# EAGLE design RangeHood (EAGLE 8.5.0)

## Sheet 1 of 2
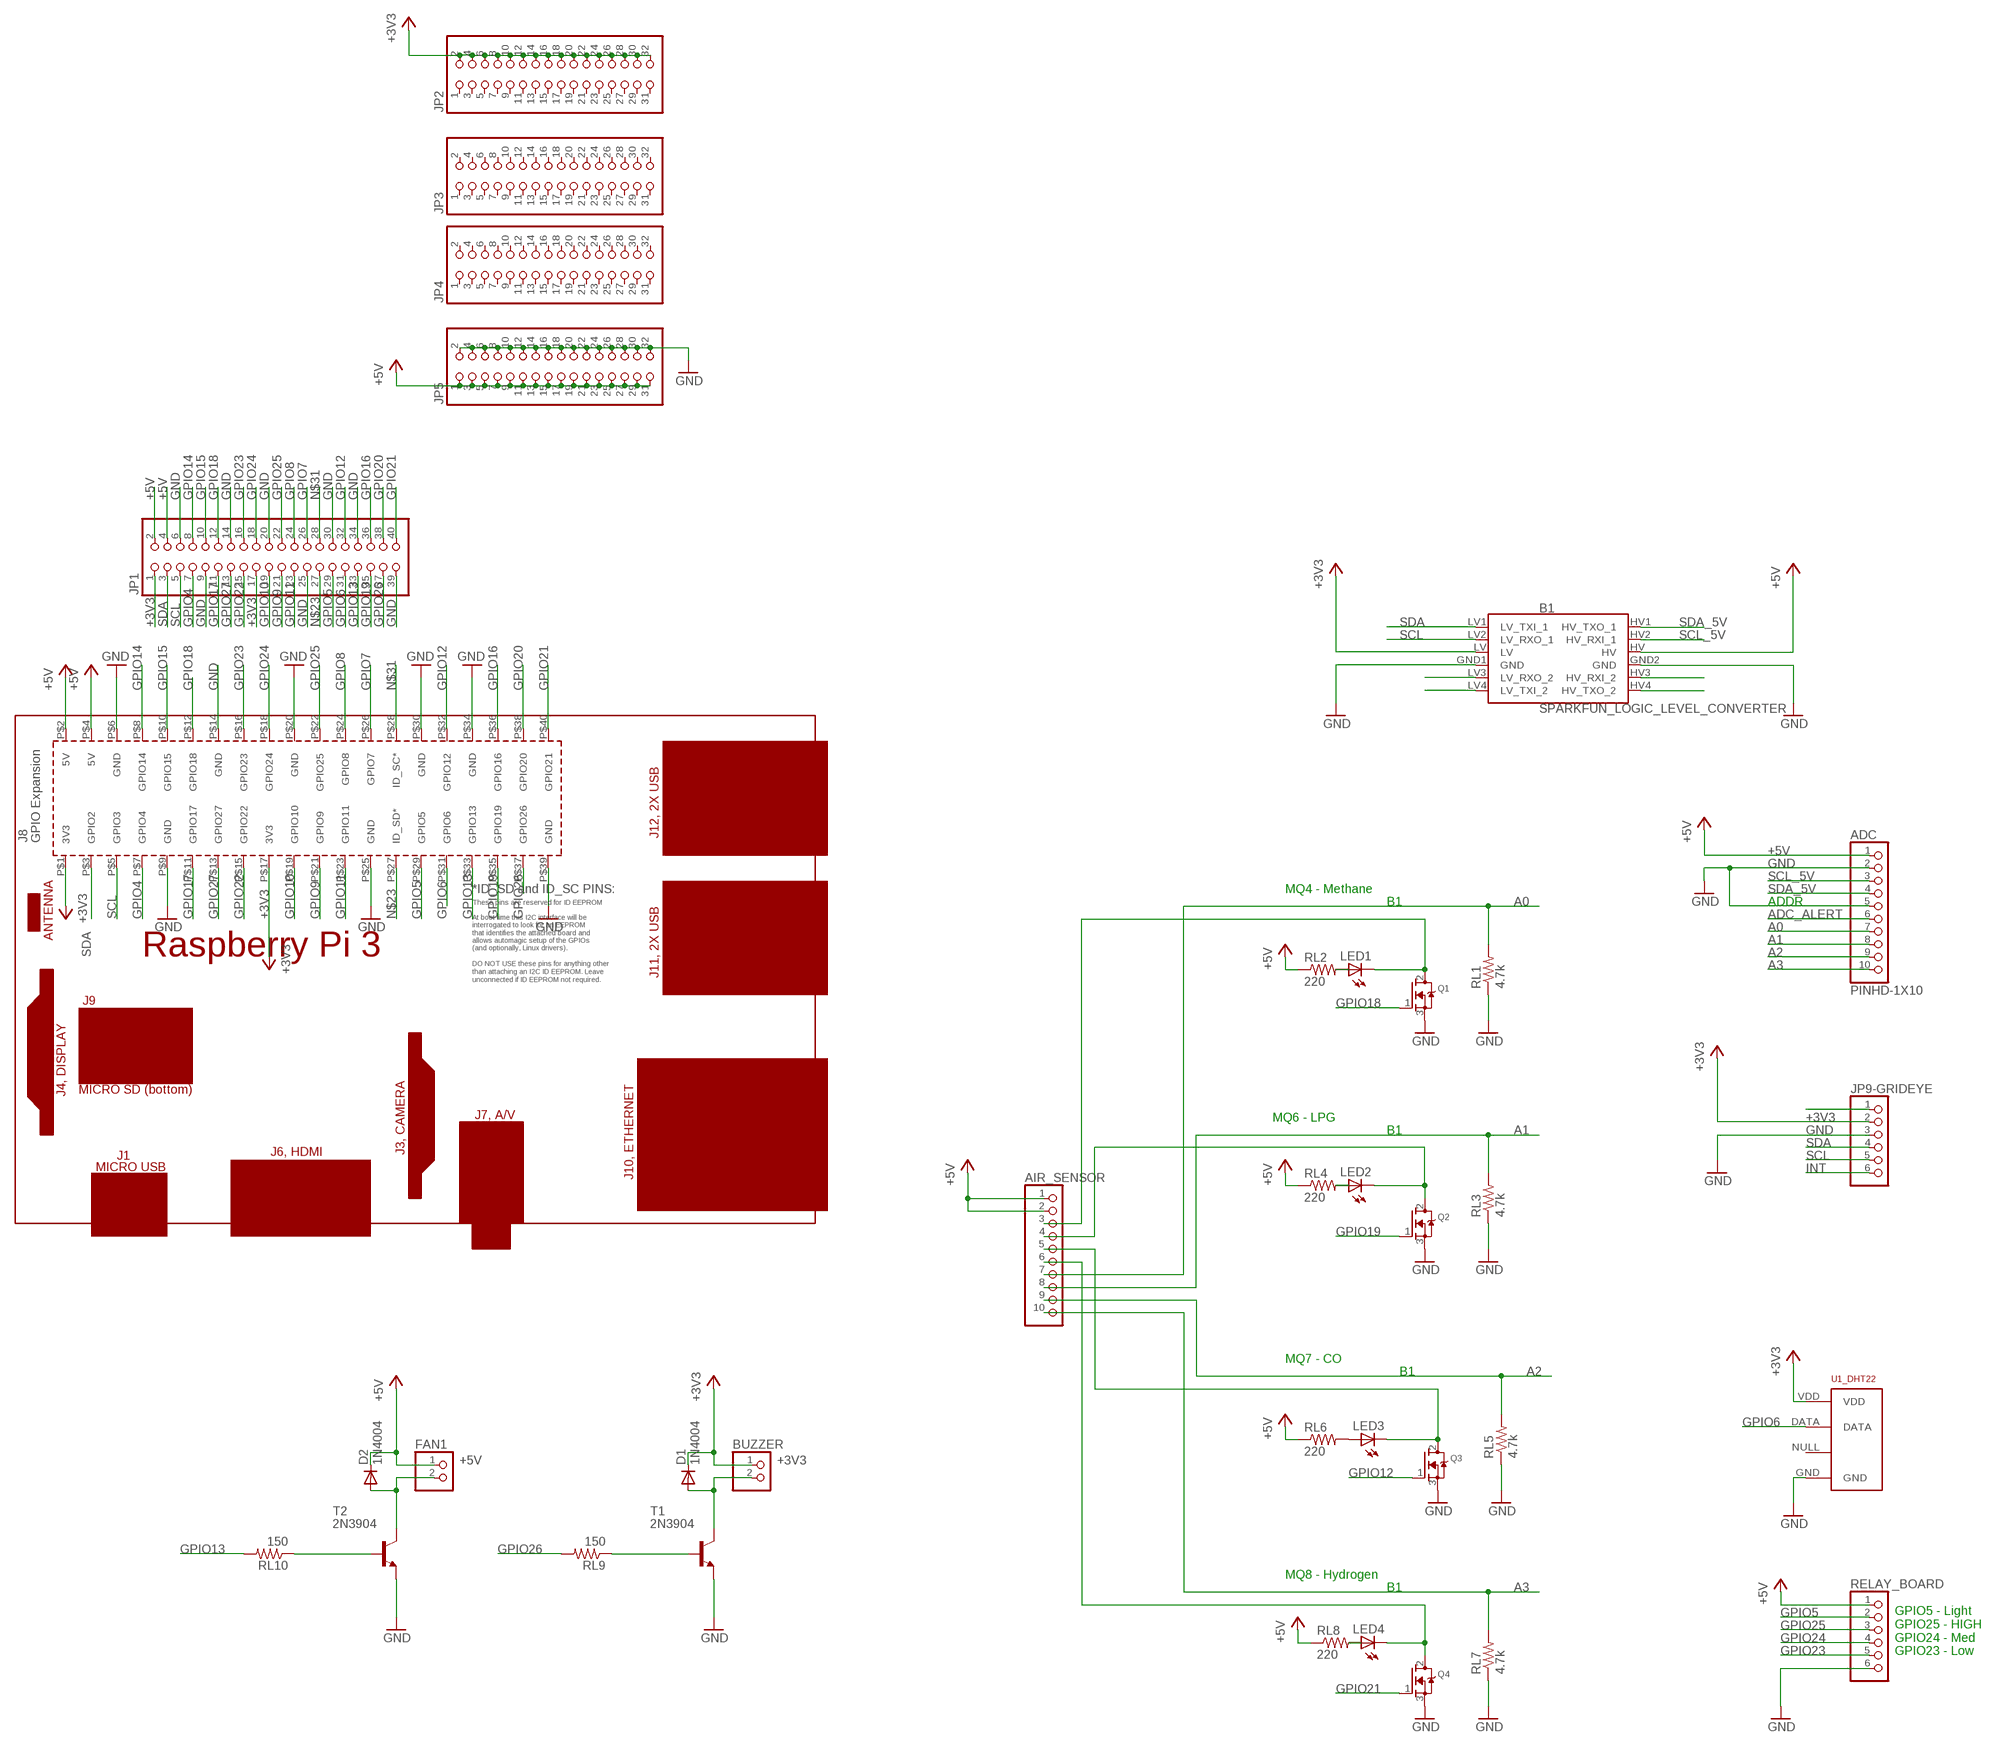
[diagram p0: schematic, sheet 1]

### Parts
ADC  PINHD-1X10  [1X10-BIG]
AIR_SENSOR  PINHD-1X10  [1X10]
B1  SPARKFUN_LOGIC_LEVEL_CONVERTER  [SPARKFUN_LOGIC_LEVEL_CONVERTER]
BUZZER  PINHD-1X2  [1X02]
D1  1N4004  [DO41-10]
D2  1N4004  [DO41-10]
FAN1  PINHD-1X2  [1X02]
JP1  PINHD-2X20  [2X20]
JP2  PINHD-2X16  [2X16]
JP3  PINHD-2X16  [2X16]
JP4  PINHD-2X16  [2X16]
JP5  PINHD-2X16  [2X16]
JP9-GRIDEYE  PINHD-1X6  [1X06]
LED1  LED3MM  [LED3MM]
LED2  LED3MM  [LED3MM]
LED3  LED3MM  [LED3MM]
LED4  LED3MM  [LED3MM]
PCB1  RPI3  [RPI3]
Q1  MOSFET-NGDS_TO220V  [TO220V]
Q2  MOSFET-NGDS_TO220V  [TO220V]
Q3  MOSFET-NGDS_TO220V  [TO220V]
Q4  MOSFET-NGDS_TO220V  [TO220V]
RELAY_BOARD  PINHD-1X6  [1X06]
RL1  4.7k  R-US_M0805  [M0805]
RL2  220  R-US_M0805  [M0805]
RL3  4.7k  R-US_M0805  [M0805]
RL4  220  R-US_M0805  [M0805]
RL5  4.7k  R-US_M0805  [M0805]
RL6  220  R-US_M0805  [M0805]
RL7  4.7k  R-US_M0805  [M0805]
RL8  220  R-US_M0805  [M0805]
RL9  150  R-US_M0805  [M0805]
RL10  150  R-US_M0805  [M0805]
T1  2N3904  [TO92]
T2  2N3904  [TO92]
U1_DHT22  RHT03_DHT-22_AM2302  [RHT03_DHT-22]

### Nets
+3V3: B1.LV BUZZER.1 D1.C JP1.1 JP1.17 JP2.2 JP2.4 JP2.6 JP2.8 JP2.10 JP2.12 JP2.14 JP2.16 JP2.18 JP2.20 JP2.22 JP2.24 JP2.26 JP2.28 JP2.30 JP2.32 JP9-GRIDEYE.2 PCB1.P$1(3V3) PCB1.P$17(3V3) U1_DHT22.VDD
+5V: ADC.1 AIR_SENSOR.1 AIR_SENSOR.2 B1.HV D2.C FAN1.1 JP1.2 JP1.4 JP5.1 JP5.3 JP5.5 JP5.7 JP5.9 JP5.11 JP5.13 JP5.15 JP5.17 JP5.19 JP5.21 JP5.23 JP5.25 JP5.27 JP5.29 JP5.31 PCB1.P$2(5V) PCB1.P$4(5V) RELAY_BOARD.1 RL2.1 RL4.1 RL6.1 RL8.1
A0: ADC.7 AIR_SENSOR.7 RL1.2
A1: ADC.8 AIR_SENSOR.8 RL3.2
A2: ADC.9 AIR_SENSOR.9 RL5.2
A3: ADC.10 AIR_SENSOR.10 RL7.2
ADC_ALERT: ADC.6
GND: ADC.2 ADC.5 B1.GND1(GND) B1.GND2(GND) JP1.6 JP1.9 JP1.14 JP1.20 JP1.25 JP1.30 JP1.34 JP1.39 JP5.2 JP5.4 JP5.6 JP5.8 JP5.10 JP5.12 JP5.14 JP5.16 JP5.18 JP5.20 JP5.22 JP5.24 JP5.26 JP5.28 JP5.30 JP5.32 JP9-GRIDEYE.3 PCB1.P$6(GND) PCB1.P$9(GND) PCB1.P$14(GND) PCB1.P$20(GND) PCB1.P$25(GND) PCB1.P$30(GND) PCB1.P$34(GND) PCB1.P$39(GND) Q1.3(S) Q2.3(S) Q3.3(S) Q4.3(S) RELAY_BOARD.6 RL1.1 RL3.1 RL5.1 RL7.1 T1.3(E) T2.3(E) U1_DHT22.GND
GPIO4: JP1.7 PCB1.P$7(GPIO4)
GPIO5: JP1.29 PCB1.P$29(GPIO5) RELAY_BOARD.2
GPIO6: JP1.31 PCB1.P$31(GPIO6) U1_DHT22.DATA
GPIO7: JP1.26 PCB1.P$26(GPIO7)
GPIO8: JP1.24 PCB1.P$24(GPIO8)
GPIO9: JP1.21 PCB1.P$21(GPIO9)
GPIO10: JP1.19 PCB1.P$19(GPIO10)
GPIO11: JP1.23 PCB1.P$23(GPIO11)
GPIO12: JP1.32 PCB1.P$32(GPIO12) Q3.1(G)
GPIO13: JP1.33 PCB1.P$33(GPIO13) RL10.2
GPIO14: JP1.8 PCB1.P$8(GPIO14)
GPIO15: JP1.10 PCB1.P$10(GPIO15)
GPIO16: JP1.36 PCB1.P$36(GPIO16)
GPIO17: JP1.11 PCB1.P$11(GPIO17)
GPIO18: JP1.12 PCB1.P$12(GPIO18) Q1.1(G)
GPIO19: JP1.35 PCB1.P$35(GPIO19) Q2.1(G)
GPIO20: JP1.38 PCB1.P$38(GPIO20)
GPIO21: JP1.40 PCB1.P$40(GPIO21) Q4.1(G)
GPIO22: JP1.15 PCB1.P$15(GPIO22)
GPIO23: JP1.16 PCB1.P$16(GPIO23) RELAY_BOARD.5
GPIO24: JP1.18 PCB1.P$18(GPIO24) RELAY_BOARD.4
GPIO25: JP1.22 PCB1.P$22(GPIO25) RELAY_BOARD.3
GPIO26: JP1.37 PCB1.P$37(GPIO26) RL9.2
GPIO27: JP1.13 PCB1.P$13(GPIO27)
INT: JP9-GRIDEYE.6
N$1: LED2.A RL4.2
N$2: AIR_SENSOR.5 LED3.K(C) Q3.2(D)
N$3: LED1.A RL2.2
N$4: AIR_SENSOR.3 LED1.K(C) Q1.2(D)
N$5: LED3.A RL6.2
N$6: D2.A FAN1.2 T2.1(C)
N$7: LED4.A RL8.2
N$8: AIR_SENSOR.6 LED4.K(C) Q4.2(D)
N$9: BUZZER.2 D1.A T1.1(C)
N$10: JP9-GRIDEYE.1
N$11: RL9.1 T1.2(B)
N$12: RL10.1 T2.2(B)
N$16: B1.LV3(LV_RXO_2)
N$17: B1.LV4(LV_TXI_2)
N$18: B1.HV4(HV_TXO_2)
N$19: B1.HV3(HV_RXI_2)
N$23: JP1.27 PCB1.P$27(ID_SD*)
N$31: JP1.28 PCB1.P$28(ID_SC*)
N$41: AIR_SENSOR.4 LED2.K(C) Q2.2(D)
SCL: B1.LV2(LV_RXO_1) JP1.5 JP9-GRIDEYE.5 PCB1.P$5(GPIO3)
SCL_5V: ADC.3 B1.HV2(HV_RXI_1)
SDA: B1.LV1(LV_TXI_1) JP1.3 JP9-GRIDEYE.4 PCB1.P$3(GPIO2)
SDA_5V: ADC.4 B1.HV1(HV_TXO_1)
Unconnected: JP2.1 JP2.3 JP2.5 JP2.7 JP2.9 JP2.11 JP2.13 JP2.15 JP2.17 JP2.19 JP2.21 JP2.23 JP2.25 JP2.27 JP2.29 JP2.31 JP3.1 JP3.2 JP3.3 JP3.4 JP3.5 JP3.6 JP3.7 JP3.8 JP3.9 JP3.10 JP3.11 JP3.12 JP3.13 JP3.14 JP3.15 JP3.16 JP3.17 JP3.18 JP3.19 JP3.20 JP3.21 JP3.22 JP3.23 JP3.24 JP3.25 JP3.26 JP3.27 JP3.28 JP3.29 JP3.30 JP3.31 JP3.32 JP4.1 JP4.2 JP4.3 JP4.4 JP4.5 JP4.6 JP4.7 JP4.8 JP4.9 JP4.10 JP4.11 JP4.12 JP4.13 JP4.14 JP4.15 JP4.16 JP4.17 JP4.18 JP4.19 JP4.20 JP4.21 JP4.22 JP4.23 JP4.24 JP4.25 JP4.26 JP4.27 JP4.28 JP4.29 JP4.30 JP4.31 JP4.32 U1_DHT22.NULL

### Notes on the sheet
- MQ4 - Methane
- B1 | ADDR
- MQ6 - LPG
- B1
- MQ7 - CO
- B1
- MQ8 - Hydrogen
- B1
- GPIO5 - Light
  GPIO25 - HIGH
  GPIO24 - Med
  GPIO23 - Low

## Sheet 2 of 2

## Library data of the parts
ADC = adafruit:PINHD-1X10: Pin header 1x10 0.1" spacing With round pins
AIR_SENSOR = pinhead:PINHD-1X10: PIN HEADER
B1 = SparkFun-Boards:SPARKFUN_LOGIC_LEVEL_CONVERTER: SparkFun Logic Level Converter -Bi-Directional This is the mechnical outline for the 3.3V - 5V bi directional logic level converter. *Note, the "LOCK" Package has the header pins staggered by an offset of 5 mils (off center line), so that when you slide a row of standard 0.1" headers into the PTH pads, it will hold position vertically. See the follwing turorial for more information on this type of special footprints: Sneaky Footprints <https://www.sparkfun.com/tutorials/114> SparkFun Products: SparkFun Logic Level Converter - Bi-Directional <https://www.sparkfun.com/products/12009>
BUZZER FAN1 = pinhead:PINHD-1X2: PIN HEADER
D1 D2 = adafruit:1N4004: DIODE General purpose 1N400x type rectifier (With bigger pads) http://www.ladyada.net/library/pcb/eaglelibrary.html
JP1 = pinhead:PINHD-2X20: PIN HEADER
JP2-JP5 = pinhead:PINHD-2X16: PIN HEADER
JP9-GRIDEYE RELAY_BOARD = pinhead:PINHD-1X6: PIN HEADER
LED1-LED4 = adafruit:LED: LED OSRAM: - CHIPLED LG R971, LG N971, LY N971, LG Q971, LY Q971, LO R971, LY R971 LH N974, LH R974 LS Q976, LO Q976, LY Q976 LO Q996 - Hyper CHIPLED LW Q18S LB Q993, LB Q99A, LB R99A - SideLED LS A670, LO A670, LY A670, LG A670, LP A670 LB A673, LV A673, LT A673, LW A673 LH A674 LY A675 LS A676, LA A676, LO A676, LY A676, LW A676 LS A679, LY A679, LG A679 - Hyper Micro SIDELED® LS Y876, LA Y876, LO Y876, LY Y876 LT Y87S - SmartLED LW L88C, LW L88S LB L89C, LB L89S, LG L890 LS L89K, LO L89K, LY L89K LS L896, LA L896, LO L896, LY L896 - TOPLED LS T670, LO T670, LY T670, LG T670, LP T670 LSG T670, LSP T670, LSY T670, LOP T670, LYG T670 LG T671, LOG T671, LSG T671 LB T673, LV T673, LT T673, LW T673 LH T674 LS T676, LA T676, LO T676, LY T676, LB T676, LH T676, LSB T676, LW T676 LB T67C, LV T67C, LT T67C, LS T67K, LO T67K, LY T67K, LW E67C LS E67B, LA E67B, LO E67B, LY E67B, LB E67C, LV E67C, LT E67C LW T67C LS T679, LY T679, LG T679 LS T770, LO T770, LY T770, LG T770, LP T770 LB T773, LV T773, LT T773, LW T773 LH T774 LS E675, LA E675, LY E675, LS T675 LS T776, LA T776, LO T776, LY T776, LB T776 LHGB T686 LT T68C, LB T68C - Hyper Mini TOPLED® LB M676 - Mini TOPLED Santana® LG M470 LS M47K, LO M47K, LY M47K Source: http://www.osram.convergy.de/
PCB1 = e14_Rpi3_RevA:RPI3: Device for Raspberry Pi 3 board created by Dave Young for www.element14.com More information and support community is available at https://www.element14.com/community/community/raspberry-pi
Q1-Q4 = adafruit:MOSFET-N: N-Channel Mosfet 2N7002E - 60V 260mA SOT23 [Digikey: 2N7002ET1GOSTR-ND] - REEL BSH103 - 30V 850mA SOT23 [Digikey: 568-5013-1-ND]
RL1-RL10 = adafruit:R-US_: RESISTOR, American symbol
T1 T2 = transistor:2N3904: NPN TRANSISTOR
U1_DHT22 = RHT03_DHT-22_AM2302:RHT03_DHT-22_AM2302: RHT03 / DHT-22 / AM2302 Packages and symbol for the RHT03 / DHT-22 relative humidity and temperature sensor. Note: The AM2302 is a wired version of the DHT-22 which typically requires less clearance and is thus provided as a separate package.; PROD_ID: SEN-10167

## Board
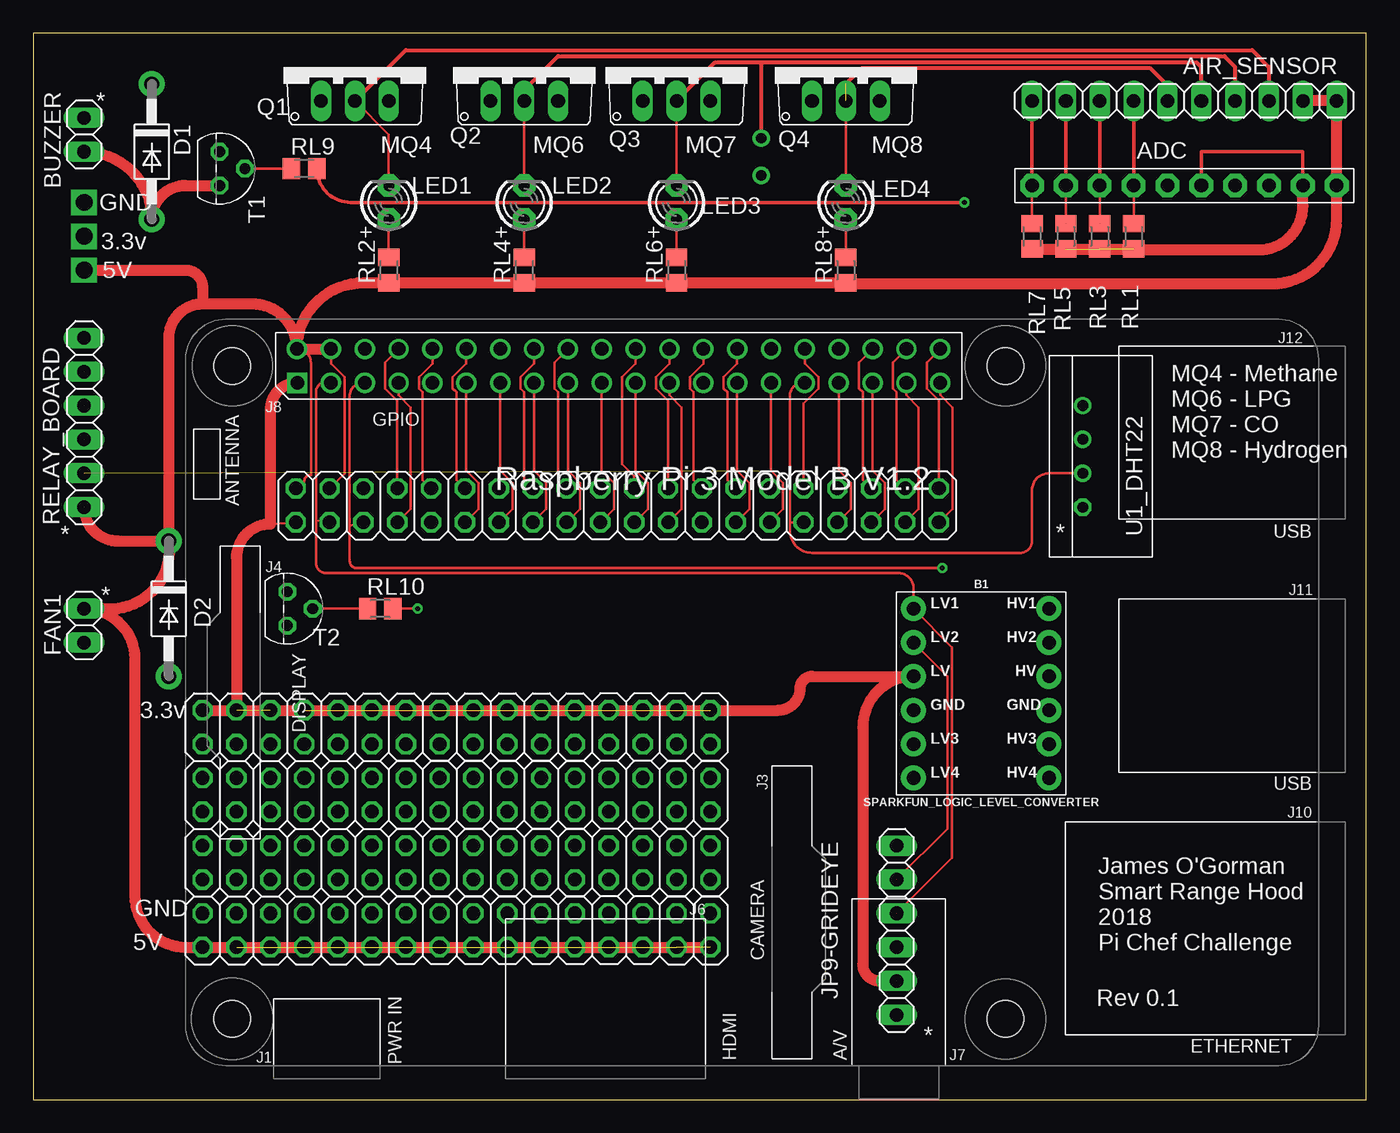
[diagram p1: board, top side]
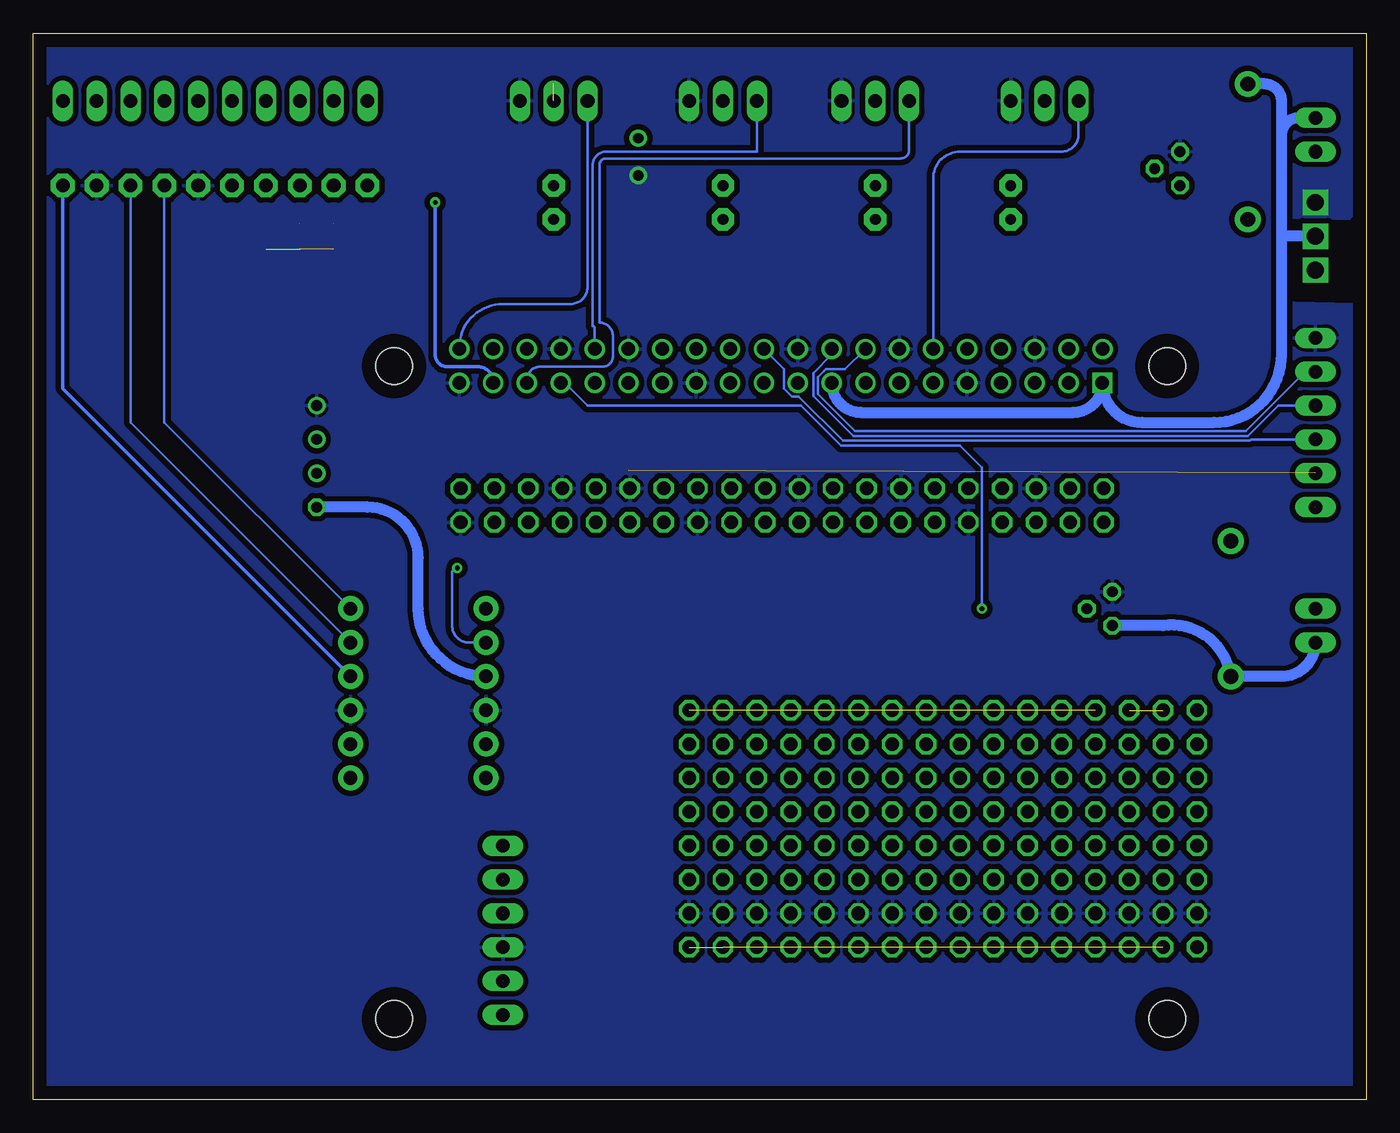
[diagram p2: board, bottom side, seen from below]

Size 100 x 80 mm. Coordinates in mm from the lower left corner, seen from the top.
Outline: 0,0 100,0 100,80 0,80 0,0
Copper layers (1*16): Top 0.035mm / dielectric 1.5mm / Bottom 0.035mm
Design rules "default": minimum track width 6mil, minimum drill 0.35mm, track to track 6mil, track to pad 6mil, pad to pad 6mil, via to via 6mil, smd to smd 6mil, copper to edge 40mil, drill to drill 6mil, minimum pad ring 10mil, minimum via ring 8mil, stop-mask expansion 4mil, vias tented up to drill 0mil, thermal gap 10mil

### Footprints (pad centres in the part's own frame; a part is rotated, then mirrored left to right if it is on the bottom)
1X10-BIG = drill 1.016 pad 1.778 octagon: 1 -11.43,0; 2 -8.89,0; 3 -6.35,0; 4 -3.81,0; 5 -1.27,0; 6 1.27,0; 7 3.81,0; 8 6.35,0; 9 8.89,0; 10 11.43,0
1X10 = drill 1.016 long: 1 -11.43,0; 2 -8.89,0; 3 -6.35,0; 4 -3.81,0; 5 -1.27,0; 6 1.27,0; 7 3.81,0; 8 6.35,0; 9 8.89,0; 10 11.43,0
SPARKFUN_LOGIC_LEVEL_CONVERTER = drill 1.016 pad 1.88: GND1 -5.08,-1.27; GND2 5.08,-1.27; HV 5.08,1.27; HV1 5.08,6.35; HV2 5.08,3.81; HV3 5.08,-3.81; HV4 5.08,-6.35; LV -5.08,1.27; LV1 -5.08,6.35; LV2 -5.08,3.81; LV3 -5.08,-3.81; LV4 -5.08,-6.35
1X02 = drill 1.016 long: 1 -1.27,0; 2 1.27,0
DO41-10 = drill 1.118 pad 1.93: A 5.08,0; C -5.08,0
2X20 = drill 1.016 octagon: 1 -24.13,-1.27; 2 -24.13,1.27; 3 -21.59,-1.27; 4 -21.59,1.27; 5 -19.05,-1.27; 6 -19.05,1.27; 7 -16.51,-1.27; 8 -16.51,1.27; 9 -13.97,-1.27; 10 -13.97,1.27; 11 -11.43,-1.27; 12 -11.43,1.27; 13 -8.89,-1.27; 14 -8.89,1.27; 15 -6.35,-1.27; 16 -6.35,1.27; 17 -3.81,-1.27; 18 -3.81,1.27; 19 -1.27,-1.27; 20 -1.27,1.27; 21 1.27,-1.27; 22 1.27,1.27; 23 3.81,-1.27; 24 3.81,1.27; 25 6.35,-1.27; 26 6.35,1.27; 27 8.89,-1.27; 28 8.89,1.27; 29 11.43,-1.27; 30 11.43,1.27; 31 13.97,-1.27; 32 13.97,1.27; 33 16.51,-1.27; 34 16.51,1.27; 35 19.05,-1.27; 36 19.05,1.27; 37 21.59,-1.27; 38 21.59,1.27; 39 24.13,-1.27; 40 24.13,1.27
2X16 = drill 1.016 octagon: 1 -19.05,-1.27; 2 -19.05,1.27; 3 -16.51,-1.27; 4 -16.51,1.27; 5 -13.97,-1.27; 6 -13.97,1.27; 7 -11.43,-1.27; 8 -11.43,1.27; 9 -8.89,-1.27; 10 -8.89,1.27; 11 -6.35,-1.27; 12 -6.35,1.27; 13 -3.81,-1.27; 14 -3.81,1.27; 15 -1.27,-1.27; 16 -1.27,1.27; 17 1.27,-1.27; 18 1.27,1.27; 19 3.81,-1.27; 20 3.81,1.27; 21 6.35,-1.27; 22 6.35,1.27; 23 8.89,-1.27; 24 8.89,1.27; 25 11.43,-1.27; 26 11.43,1.27; 27 13.97,-1.27; 28 13.97,1.27; 29 16.51,-1.27; 30 16.51,1.27; 31 19.05,-1.27; 32 19.05,1.27
1X06 = drill 1.016 long: 1 -6.35,0; 2 -3.81,0; 3 -1.27,0; 4 1.27,0; 5 3.81,0; 6 6.35,0
LED3MM = drill 0.813 pad 1.676 octagon: A -1.27,0; K 1.27,0
RPI3 = drill 1.016 square: P$1 8.37,51.23 | drill 1.016: P$2 8.357,53.772; P$3 10.897,51.232; P$4 10.897,53.772; P$5 13.437,51.232; P$6 13.437,53.772; P$7 15.977,51.232; P$8 15.977,53.772; P$9 18.517,51.232; P$10 18.517,53.772; P$11 21.057,51.232; P$12 21.057,53.772; P$13 23.597,51.232; P$14 23.597,53.772; P$15 26.137,51.232; P$16 26.137,53.772; P$17 28.677,51.232; P$18 28.677,53.772; P$19 31.217,51.232; P$20 31.217,53.772; P$21 33.757,51.232; P$22 33.757,53.772; P$23 36.297,51.232; P$24 36.297,53.772; P$25 38.837,51.232; P$26 38.837,53.772; P$27 41.377,51.232; P$28 41.377,53.772; P$29 43.917,51.232; P$30 43.917,53.772; P$31 46.457,51.232; P$32 46.457,53.772; P$33 48.997,51.232; P$34 48.997,53.772; P$35 51.537,51.232; P$36 51.537,53.772; P$37 54.077,51.232; P$38 54.077,53.772; P$39 56.617,51.232; P$40 56.617,53.772 | hole 2.75: 3.5,3.5; 61.5,3.5; 3.5,52.5; 61.5,52.5
TO220V = drill 1.016 long: 1 -2.54,-2.54; 2 0,-2.54; 3 2.54,-2.54
M0805 = smd 1.3 x 1.6: 1 -0.95,0; 2 0.95,0
TO92 = drill 0.813 octagon: 1 1.27,0; 2 0,1.905; 3 -1.27,0
RHT03_DHT-22 = drill 0.8: DATA -1.27,0; GND 3.81,0; NULL 1.27,0 | drill 0.8 octagon: VDD -3.81,0

### Placement (x,y rotation side)
ADC  86.36,68.58 180 top
AIR_SENSOR  86.36,74.93 180 top
B1  71.12,30.48 0 top
BUZZER  3.81,72.39 270 top
D1  8.89,71.12 270 top
D2  10.16,36.83 270 top
FAN1  3.81,35.56 270 top
JP1  43.81,44.58 0 top
JP2  31.75,27.94 0 top
JP3  31.75,22.86 0 top
JP4  31.75,17.78 0 top
JP5  31.75,12.7 0 top
JP9-GRIDEYE  64.77,12.7 90 top
LED1  26.67,67.31 90 top
LED2  36.83,67.31 90 top
LED3  48.26,67.31 90 top
LED4  60.96,67.31 90 top
PCB1  11.43,2.54 0 top
Q1  24.13,77.47 0 top
Q2  36.83,77.47 0 top
Q3  48.26,77.47 0 top
Q4  60.96,77.47 0 top
RELAY_BOARD  3.81,50.8 90 top
RL1  82.55,64.77 90 top
RL2  26.67,62.23 90 top
RL3  80.01,64.77 90 top
RL4  36.83,62.23 90 top
RL5  77.47,64.77 90 top
RL6  48.26,62.23 90 top
RL7  74.93,64.77 90 top
RL8  60.96,62.23 90 top
RL9  20.32,69.85 0 top
RL10  26.04,36.83 0 top
T1  13.97,69.85 270 top
T2  19.05,36.83 270 top
U1_DHT22  78.74,48.26 90 top

### Tracks (layer width: path | path; a pad name or v marks a point on that pad's centre or on a via)
+3V3  (via drill 1.27 pad 1.91)  (15 unrouted)
  Top 0.203: 17.78,43.18 JP1.1 | PCB1.P$17 40.11,47.18 41.02,46.27 41.02,44.32 JP1.17
  Top 0.813: JP2.2 JP2.4 | JP2.4 JP2.32 55.88,29.21 arc90 57.53,30.86 | PCB1.P$1 arc90 17.78,51.75 17.78,43.18 arc90 15.24,40.64 JP2.4 | 57.53,30.86 57.53,30.99 | 57.53,30.86 arc-90 58.42,31.75 B1.LV arc90 62.23,27.94 62.23,10.16 arc90 63.5,8.89 JP9-GRIDEYE.2
  Bottom 0.813: 6.35,64.77 6.35,55.88 arc90 11.43,50.8 16.83,50.8 arc90 PCB1.P$1 19.8,53.73 arc90 21.97,51.56 37.9,51.56 arc90 PCB1.P$17 | B1.LV arc90 71.12,36.83 71.12,40.64 arc-90 74.93,44.45 U1_DHT22.VDD | v3.81,64.77 6.35,64.77 | 6.35,64.77 6.35,72.39 | 6.35,72.39 arc90 5.08,73.66 BUZZER.1 | 6.35,72.39 6.35,74.93 arc-90 7.62,76.2 D1.C
+5V  (via drill 1.27 pad 1.91)  (15 unrouted)
  Top 0.203: 20.32,45.85 JP1.2 20.32,46.35 arc-90 20.83,46.86 20.83,55.27 arc90 PCB1.P$2 | PCB1.P$4 22.33,55.21 23.34,54.19 23.34,46.97 JP1.4
  Top 0.813: PCB1.P$2 PCB1.P$4 | PCB1.P$2 arc-90 24.75,61.28 RL2.1 RL4.1 RL6.1 RL8.1 arc90 61.03,61.21 92.96,61.21 arc90 97.79,66.04 ADC.1 AIR_SENSOR.1 AIR_SENSOR.2 | PCB1.P$2 arc90 16.41,59.69 12.7,59.69 | 12.7,59.69 arc90 10.16,57.15 D2.C | D2.C arc-90 6.35,36.83 FAN1.1 arc-90 7.62,33.02 7.62,15.24 arc90 11.43,11.43 JP5.1 JP5.31 | v3.81,62.23 11.43,62.23 arc-90 12.7,60.96 12.7,59.69 | RELAY_BOARD.1 arc90 6.35,41.91 D2.C
  Bottom 0.254: B1.HV 97.79,53.34 ADC.1 | FAN1.1 2.54,36.83
A0
  Top 0.203: ADC.7 RL1.2
  Top 0.254: AIR_SENSOR.7 ADC.7
A1  (1 unrouted)
  Top 0.203: RL3.2 arc90 RL3.2 | RL3.2 ADC.8
  Top 0.254: AIR_SENSOR.8 ADC.8
A2  (1 unrouted)
  Top 0.203: RL5.2 ADC.9
  Top 0.254: AIR_SENSOR.9 ADC.9
A3
  Top 0.203: ADC.10 RL7.2
  Top 0.254: AIR_SENSOR.10 ADC.10
GND  (via drill 0.76 pad 1.3, 1.27 pad 1.91)  (2 unrouted)
  Top 0.203: PCB1.P$39 68.05,52.84 68.96,51.92 68.96,44.32 JP1.39
  Top 0.254: ADC.5 87.63,71.12 95.25,71.12 ADC.2 | JP9-GRIDEYE.3 66.04,11.43
  Top 0.813: RL7.1 RL1.1 arc90 82.62,63.75 91.95,63.75 arc90 95.25,67.06 ADC.2
  Bottom 0.203: PCB1.P$39 68.53,53.29
  other vias: 3.81,67.31 54.61,69.34
  pour Bottom (isolate 0.406): 0.38,79.5 99.57,79.5 99.57,0.25 0.38,0.25 0.38,59.18 0.89,59.69 6.86,59.82 6.86,66.17 1.27,66.04 0.38,66.93
GPIO4
  Top 0.203: PCB1.P$7 27.41,52.84 28.32,51.92 28.32,44.32 JP1.7
GPIO5  (1 unrouted)
  Top 0.203: PCB1.P$29 55.35,47.18 56.26,46.27 56.26,44.32 JP1.29
GPIO6
  Top 0.203: PCB1.P$31 arc90 56.77,52.91 56.77,43.18 | U1_DHT22.DATA 76.2,46.99 arc90 74.93,45.72 74.93,41.91 arc-90 74.04,41.02 58.42,41.02 arc-90 56.77,42.67 56.77,43.18 | JP1.31 56.9,43.31 56.77,43.18
GPIO7
  Top 0.203: PCB1.P$26 50.27,55.21 49.25,54.19 49.25,53.35 49.53,53.07 49.53,46.48 JP1.26
GPIO8
  Top 0.203: PCB1.P$24 47.73,55.21 46.71,54.19 46.71,53.35 47.62,52.44 JP1.24
GPIO9
  Top 0.203: PCB1.P$21 45.19,47.18 46.1,46.27 46.1,44.32 JP1.21
GPIO10
  Top 0.203: PCB1.P$19 42.65,47.18 43.56,46.27 43.56,44.32 JP1.19
GPIO11
  Top 0.203: PCB1.P$23 47.73,52.84 48.64,51.92 48.64,44.32 JP1.23
GPIO12
  Top 0.203: JP1.32 57.78,52.23 58.9,53.35 58.9,54.19 57.89,55.21 PCB1.P$32
  Bottom 0.203: Q3.1 45.72,71.12 57.02,71.12 arc-90 58.04,70.1 58.04,58.04 arc90 57.89,57.89 PCB1.P$32
GPIO13  (via drill 0.35)
  Top 0.203: RL10.2 v28.83,36.83 | PCB1.P$33 60.43,47.18 61.34,46.27 61.34,44.32 JP1.33
  Bottom 0.203: PCB1.P$33 60.12,53.77 58.42,52.07 42.41,52.07 39.42,49.07 30.48,49.07 28.83,47.42 v28.83,36.83
GPIO14
  Top 0.203: JP1.8 27.3,52.44 26.39,53.35 26.39,55.3 PCB1.P$8
GPIO15
  Top 0.203: PCB1.P$10 29.95,55.21 28.93,54.19 28.93,53.35 29.21,53.07 29.21,46.48 JP1.10
GPIO16
  Top 0.203: PCB1.P$36 61.95,55.3 61.95,53.35 62.23,53.07 62.23,46.48 JP1.36
GPIO17
  Top 0.203: PCB1.P$11 32.49,47.18 33.4,46.27 33.4,44.32 JP1.11
GPIO18
  Top 0.203: PCB1.P$12 32.49,55.21 31.47,54.19 31.47,53.35 31.75,53.07 31.75,46.48 JP1.12
  Bottom 0.203: Q1.1 21.59,72.39 arc90 22.86,71.12 30.48,71.12 arc-90 32.49,69.11 32.49,65.3 32.49,64.77 PCB1.P$12
GPIO19
  Top 0.203: PCB1.P$35 62.97,47.18 63.88,46.27 63.88,44.32 JP1.35
  Bottom 0.203: Q2.1 34.29,71.25 arc90 34.92,70.61 57.02,70.61 arc-90 57.53,70.1 57.53,60.96 57.53,60.83 57.53,58.29 arc90 56.52,57.28 56.52,55.75 arc90 57.28,54.99 61.98,54.99 arc-90 62.97,54 PCB1.P$35
GPIO20
  Top 0.203: PCB1.P$38 64.49,55.3 64.49,53.35 64.77,53.07 64.77,46.48 JP1.38
GPIO21
  Top 0.203: JP1.40 67.94,52.44 67.03,53.35 67.03,55.3 PCB1.P$40
  Bottom 0.203: PCB1.P$40 68.05,56.41 arc90 64.77,59.69 59.69,59.69 arc-90 58.42,60.96 Q4.1
GPIO22
  Top 0.203: PCB1.P$15 37.57,47.18 38.48,46.27 38.48,44.32 JP1.15
GPIO23  (1 unrouted)
  Top 0.203: PCB1.P$16 37.57,55.21 36.55,54.19 36.55,53.35 36.83,53.07 36.83,46.48 JP1.16
  Bottom 0.203: PCB1.P$16 39.09,54.79 40.53,54.79 40.67,54.64 41.12,54.19 41.12,52.92 38.34,50.14 9.02,50.14 4.55,54.61 RELAY_BOARD.5
GPIO24  (1 unrouted)
  Top 0.203: PCB1.P$18 39.09,55.3 39.09,53.35 39.37,53.07 39.37,46.48 JP1.18
  Bottom 0.203: 40.11,55.71 40.11,55.88 | 40.11,55.88 PCB1.P$18 | RELAY_BOARD.4 6.59,52.07 8.87,49.78 38.49,49.78 41.48,52.78 41.48,54.51 40.11,55.88
GPIO25  (1 unrouted)
  Top 0.203: PCB1.P$22 45.19,55.21 44.17,54.19 44.17,47.7 45.09,46.78 JP1.22
  Bottom 0.203: PCB1.P$22 43.66,54.79 43.66,53.35 43.07,52.76 42.6,52.76 39.27,49.43 8.73,49.43 8.62,49.53 RELAY_BOARD.3
GPIO26  (via drill 0.35)
  Top 0.203: PCB1.P$37 65.51,52.84 66.42,51.92 66.42,44.32 JP1.37
  Top 0.254: RL9.2 arc90 23.81,67.31 v69.85,67.31
  Bottom 0.254: v69.85,67.31 69.85,55.88 arc-90 68.96,54.99 66.67,54.99 arc90 65.51,53.82 PCB1.P$37
GPIO27
  Top 0.203: PCB1.P$13 35.03,47.18 35.94,46.27 35.94,44.32 JP1.13
N$1
  Top 0.203: LED2.A RL4.2
N$2  (via drill 0.76 pad 1.3)
  Top 0.203: Q3.2 LED3.K
  Top 0.305: Q3.2 51.16,77.83 54.61,77.83 | 54.61,77.83 87.27,77.83 87.63,77.47 AIR_SENSOR.5 | 54.61,77.83 v54.61,72.14
N$3
  Top 0.203: LED1.A RL2.2
N$4
  Top 0.203: Q1.2 26.67,72.39 LED1.K
  Top 0.305: Q1.2 27.94,78.74 91.44,78.74 92.71,77.47 AIR_SENSOR.3
N$5
  Top 0.203: LED3.A RL6.2
N$6
  Bottom 0.813: T2.1 15.24,35.56 arc90 D2.A 6.35,31.75 arc-90 FAN1.2
N$7
  Top 0.203: LED4.A RL8.2
N$8  (1 unrouted)
  Top 0.203: Q4.2 LED4.K
  Top 0.305: AIR_SENSOR.6 85.09,76.1 83.82,77.37 62.13,77.37 60.96,76.2
N$9  (1 unrouted)
  Top 0.813: BUZZER.2 arc-90 D1.A | D1.A | D1.A arc-90 11.43,68.58 T1.1
N$11
  Top 0.203: T1.2 RL9.1
N$12
  Top 0.203: T2.2 RL10.1
N$23
  Top 0.203: PCB1.P$27 52.81,47.18 53.72,46.27 53.72,44.32 JP1.27
N$31
  Top 0.203: PCB1.P$28 52.81,55.21 51.79,54.19 51.79,53.35 52.07,53.07 52.07,46.48 JP1.28
N$41
  Top 0.203: Q2.2 LED2.K
  Top 0.305: Q2.2 36.83,75.74 39.37,78.28 89.36,78.28 90.17,77.47 AIR_SENSOR.4
SCL  (via drill 0.35)  (1 unrouted)
  Top 0.203: JP9-GRIDEYE.5 68.58,20.32 68.58,31.75 B1.LV2 | PCB1.P$5 arc90 23.75,52.91 23.75,43.05 | 23.75,43.05 23.75,40.39 arc90 24.26,39.88 v68.2,39.88 | JP1.5 23.75,43.05
  Bottom 0.203: v68.2,39.88 arc-90 68.58,39.5 68.58,35.56 arc-90 67.31,34.29 B1.LV2
SCL_5V
  Bottom 0.203: ADC.3 92.71,50.8 B1.HV2
SDA  (1 unrouted)
  Top 0.203: 68.94,20.47 | 68.94,20.47 68.94,18.14 JP9-GRIDEYE.4 | 68.94,20.47 68.94,33.93 B1.LV1 66.04,38.35 arc90 64.9,39.5 21.97,39.5 arc-90 21.21,40.26 21.21,43.43 | PCB1.P$3 arc90 21.21,53.29 21.21,43.43 | JP1.3 21.21,43.43
SDA_5V
  Bottom 0.203: ADC.4 90.17,50.8 B1.HV1

### Text on the board
tNames: * | MQ4 | MQ6 | MQ7 | MQ8 | GND | 3.3v | 5V | MQ4 - Methane / MQ6 - LPG / MQ7 - CO / MQ8 - Hydrogen | * | * | * | 3.3v | GND | 5V | James O'Gorman / Smart Range Hood / 2018 / Pi Chef Challenge | Rev 0.1 | *